# Altium project BSPD_V2.PrjPcb
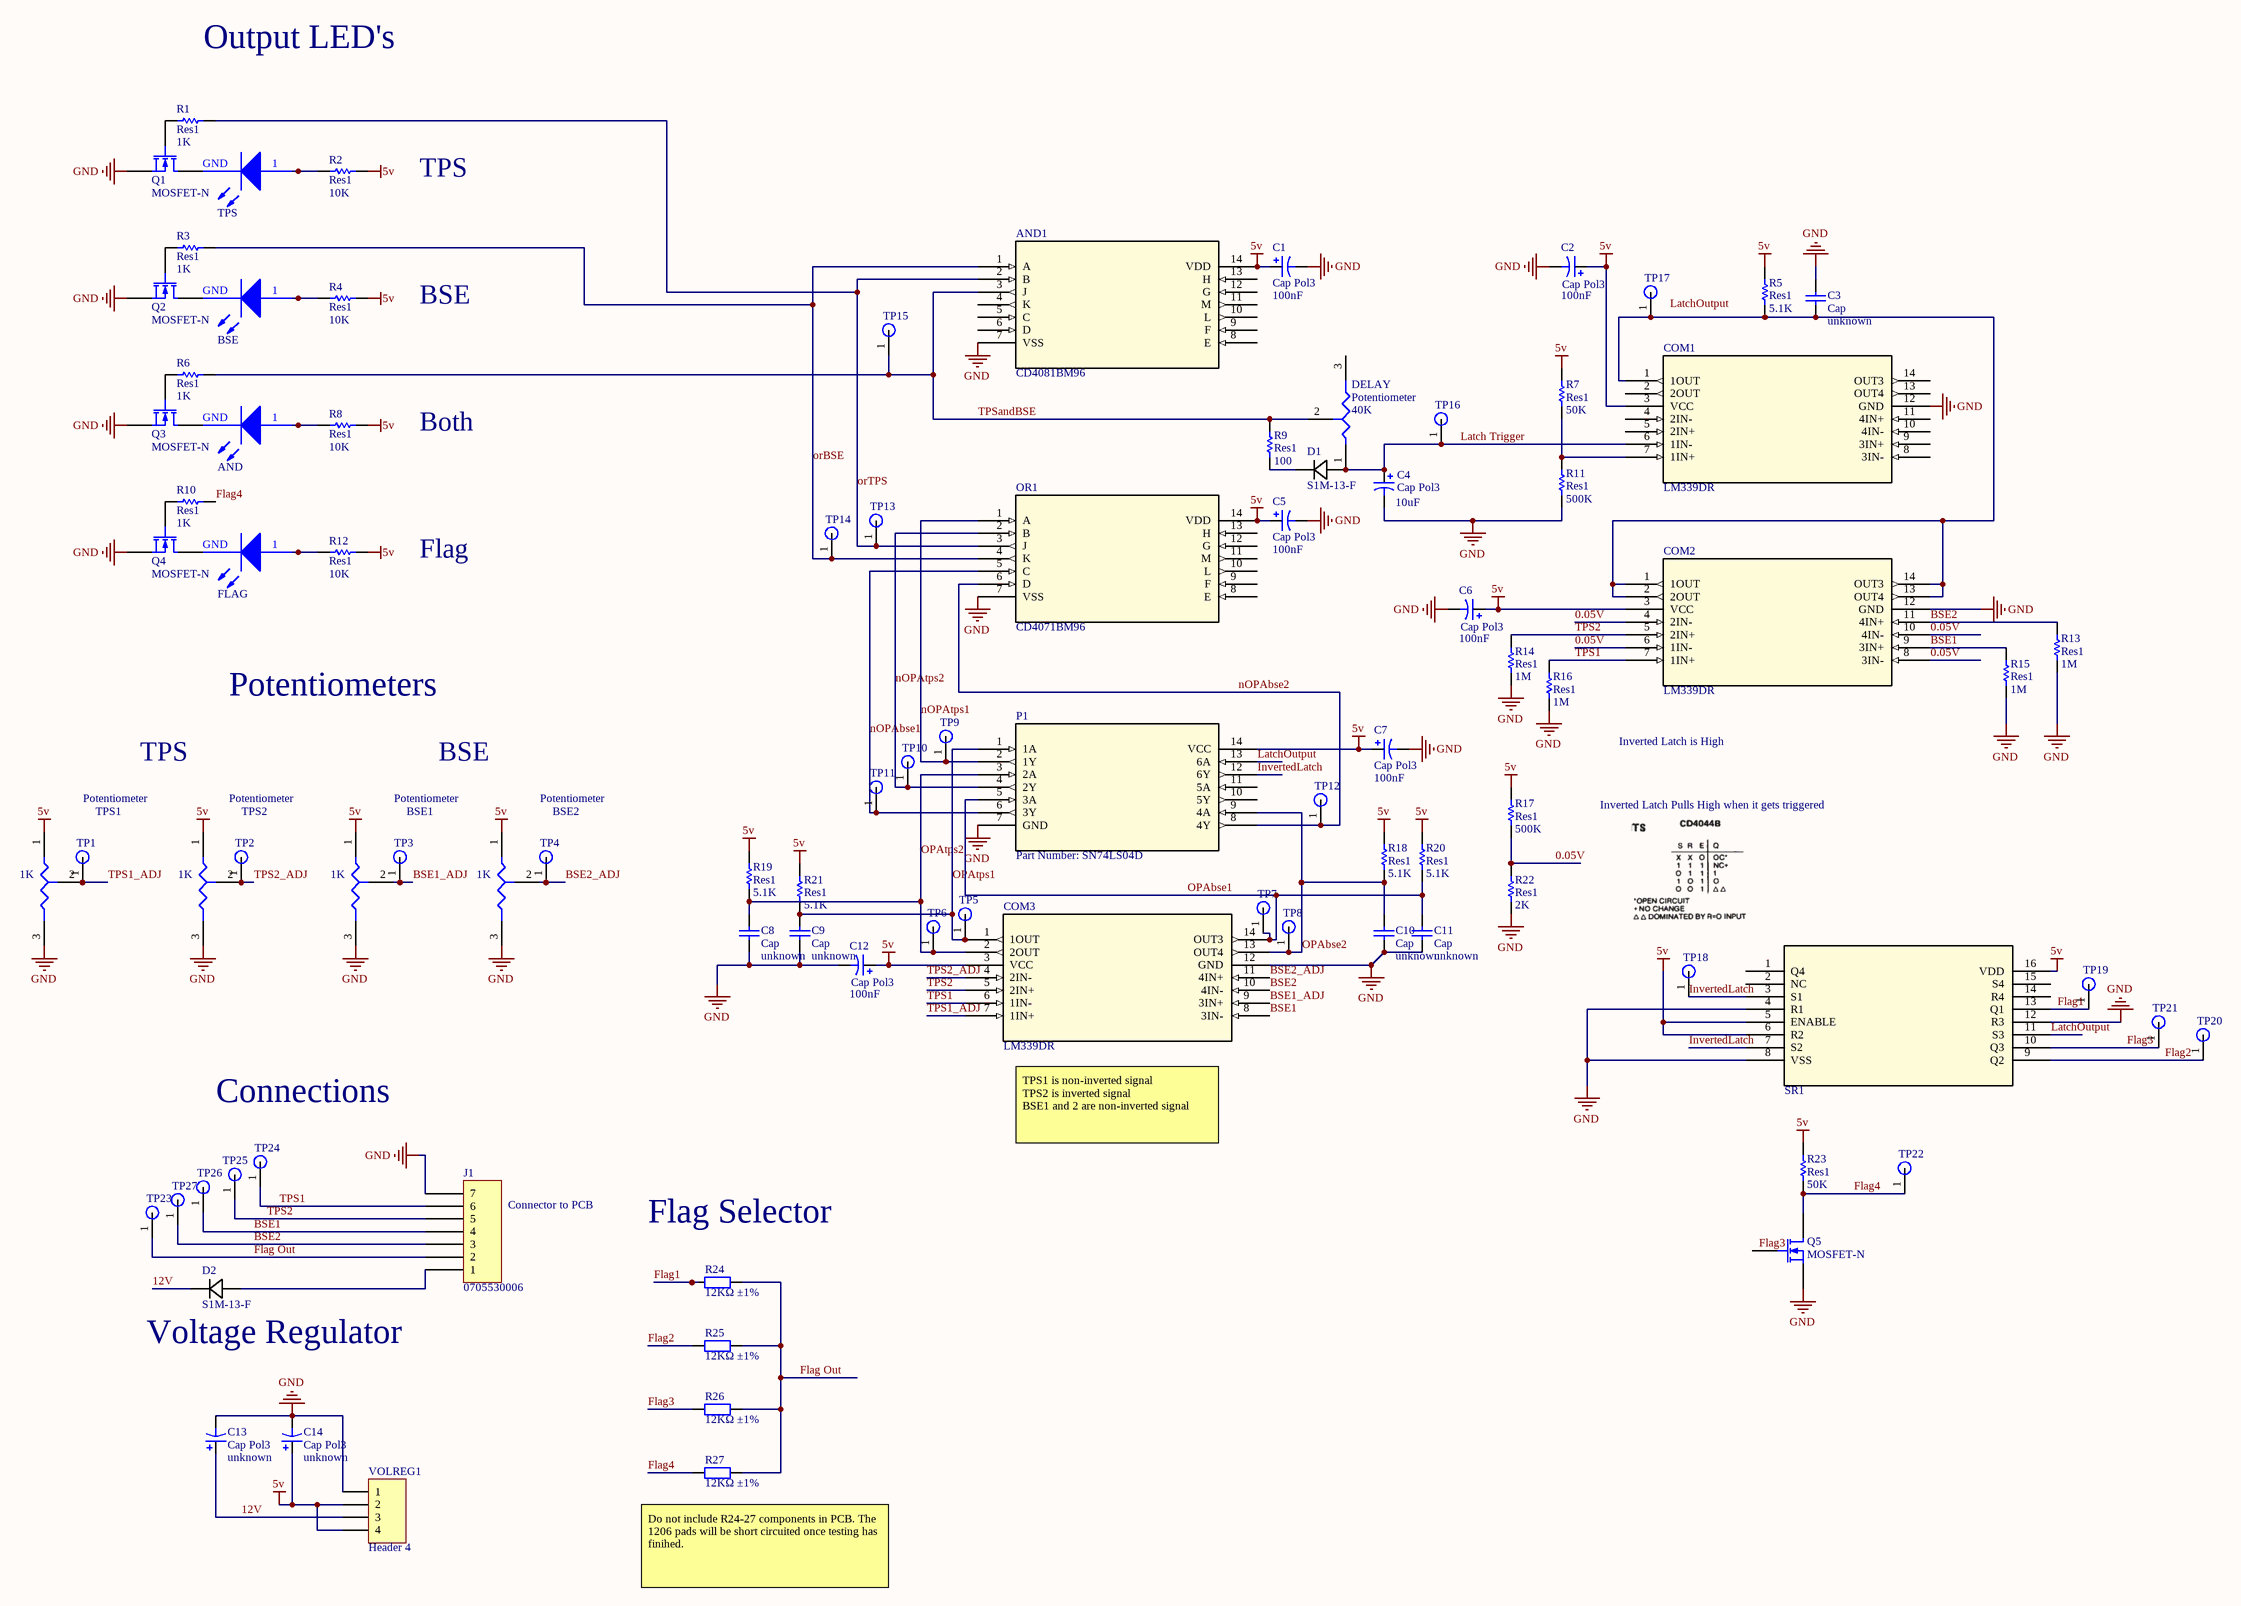
[diagram p0: BSPD_V2.1.SchDoc]
1 sheet, 93 parts. Net scope: global (net labels, ports and power ports of the same name join across sheets).
Board file: BSPD_V2.1.PcbDoc

## Sheet BSPD_V2.1.SchDoc
size C; Organization: Altium Limited; Address1: L3, 12a Rodborough Rd; Address2: Frenchs Forest; Address3: NSW; Address4: Australia 2086

### Parts
AND  Green Led  [Single_Color_LED]  (value not drawn)
AND1  CD4081BM96  [D14]
BSE  Green Led  [Single_Color_LED]  (value not drawn)
BSE1  Potentiometer  value 1K  [Potentiometers]
BSE2  Potentiometer  value 1K  [Potentiometers]
C1  Cap Pol3  value 100nF  [RC0805N]
C2  Cap Pol3  value 100nF  [RC0805N]
C3  Cap  value unknown  [RC0805N]
C4  Cap Pol3  value 10uF  [RC0805N]
C5  Cap Pol3  value 100nF  [RC0805N]
C6  Cap Pol3  value 100nF  [RC0805N]
C7  Cap Pol3  value 100nF  [RC0805N]
C8  Cap  value unknown  [RC0805N]
C9  Cap  value unknown  [RC0805N]
C10  Cap  value unknown  [RC0805N]
C11  Cap  value unknown  [RC0805N]
C12  Cap Pol3  value 100nF  [RC0805N]
C13  Cap Pol3  value unknown  [RC0805N]
C14  Cap Pol3  value unknown  [RC0805N]
COM1  LM339DR  [D14]
COM2  LM339DR  [D14]
COM3  LM339DR  [D14]
D1  S1M-13-F  [DIODE]
D2  S1M-13-F  [DIODE]
DELAY  Potentiometer  value 40K  [Potentiometers]
FLAG  Green Led  [Single_Color_LED]  (value not drawn)
J1  0705530006  [MOLEX SDA-70553-7PIN]
OR1  CD4071BM96  [D14]
P1  Part Number: SN74LS04D  [D14]
Q1  MOSFET-N  [SOT-23-3]
Q2  MOSFET-N  [SOT-23-3]
Q3  MOSFET-N  [SOT-23-3]
Q4  MOSFET-N  [SOT-23-3]
Q5  MOSFET-N  [SOT-23-3]
R1  Res1  value 1K  [RC0805N]
R2  Res1  value 10K  [RC0805N]
R3  Res1  value 1K  [RC0805N]
R4  Res1  value 10K  [RC0805N]
R5  Res1  value 5.1K  [RC0805N]
R6  Res1  value 1K  [RC0805N]
R7  Res1  value 50K  [RC0805N]
R8  Res1  value 10K  [RC0805N]
R9  Res1  value 100  [RC0805N]
R10  Res1  value 1K  [RC0805N]
R11  Res1  value 500K  [RC0805N]
R12  Res1  value 10K  [RC0805N]
R13  Res1  value 1M  [RC0805N]
R14  Res1  value 1M  [RC0805N]
R15  Res1  value 1M  [RC0805N]
R16  Res1  value 1M  [RC0805N]
R17  Res1  value 500K  [RC0805N]
R18  Res1  value 5.1K  [RC0805N]
R19  Res1  value 5.1K  [RC0805N]
R20  Res1  value 5.1K  [RC0805N]
R21  Res1  value 5.1K  [RC0805N]
R22  Res1  value 2K  [RC0805N]
R23  Res1  value 50K  [RC0805N]
R24  12KΩ ±1%  [0805_R]
R25  12KΩ ±1%  [0805_R]
R26  12KΩ ±1%  [0805_R]
R27  12KΩ ±1%  [0805_R]
SR1  CD4044BNSR  [NS16]  (value not drawn)
TP1  Test Point  [TP1]  (value not drawn)  (no BOM)
TP2  Test Point  [TP1]  (value not drawn)  (no BOM)
TP3  Test Point  [TP1]  (value not drawn)  (no BOM)
TP4  Test Point  [TP1]  (value not drawn)  (no BOM)
TP5  Test Point  [TP1]  (value not drawn)  (no BOM)
TP6  Test Point  [TP1]  (value not drawn)  (no BOM)
TP7  Test Point  [TP1]  (value not drawn)  (no BOM)
TP8  Test Point  [TP1]  (value not drawn)  (no BOM)
TP9  Test Point  [TP1]  (value not drawn)  (no BOM)
TP10  Test Point  [TP1]  (value not drawn)  (no BOM)
TP11  Test Point  [TP1]  (value not drawn)  (no BOM)
TP12  Test Point  [TP1]  (value not drawn)  (no BOM)
TP13  Test Point  [TP1]  (value not drawn)  (no BOM)
TP14  Test Point  [TP1]  (value not drawn)  (no BOM)
TP15  Test Point  [TP1]  (value not drawn)  (no BOM)
TP16  Test Point  [TP1]  (value not drawn)  (no BOM)
TP17  Test Point  [TP1]  (value not drawn)  (no BOM)
TP18  Test Point  [TP1]  (value not drawn)  (no BOM)
TP19  Test Point  [TP1]  (value not drawn)  (no BOM)
TP20  Test Point  [TP1]  (value not drawn)  (no BOM)
TP21  Test Point  [TP1]  (value not drawn)  (no BOM)
TP22  Test Point  [TP1]  (value not drawn)  (no BOM)
TP23  Test Point  [TP1]  (value not drawn)  (no BOM)
TP24  Test Point  [TP1]  (value not drawn)  (no BOM)
TP25  Test Point  [TP1]  (value not drawn)  (no BOM)
TP26  Test Point  [TP1]  (value not drawn)  (no BOM)
TP27  Test Point  [TP1]  (value not drawn)  (no BOM)
TPS  Green Led  [Single_Color_LED]  (value not drawn)
TPS1  Potentiometer  value 1K  [Potentiometers]
TPS2  Potentiometer  value 1K  [Potentiometers]
VOLREG1  Header 4  [LM1117IMPX-5.0/NOPB]

### Nets
5v: AND1.14(VDD) BSE1.1(A) BSE2.1(A) C1.1 C2.1 C5.1 C6.1 C7.1 C12.1 C14.1 COM1.3(VCC) COM2.3(VCC) COM3.3(VCC) OR1.14(VDD) P1.14(VCC) R2.1 R4.1 R5.1 R7.2 R8.1 R12.1 R17.1 R18.1 R19.1 R20.1 R21.1 R23.2 SR1.5(ENABLE) SR1.6(R2) SR1.16(VDD) TPS1.1(A) TPS2.1(A) VOLREG1.2 VOLREG1.4
GND: AND1.7(VSS) BSE1.3(B) BSE2.3(B) C1.2 C2.2 C3.2 C4.2 C5.2 C6.2 C7.2 C8.1 C9.1 C10.1 C11.1 C12.2 C13.2 C14.2 COM1.12(GND) COM2.12(GND) COM3.12(GND) J1.7 OR1.7(VSS) P1.7(GND) Q1.3(S) Q2.3(S) Q3.3(S) Q4.3(S) Q5.3(S) R11.2 R13.2 R14.2 R15.2 R16.2 R22.2 SR1.4(R1) SR1.8(VSS) SR1.12(R3) TPS1.3(B) TPS2.3(B) VOLREG1.1
0.05V: COM2.4(2IN-) COM2.6(1IN-) COM2.8(3IN-) COM2.10(4IN-) R17.2 R22.1
12V: C13.1 D2.1 VOLREG1.3
BSE1: COM2.9(3IN+) COM3.8(3IN-) J1.4 R15.1 TP26.1
BSE1_ADJ: BSE1.2(TAP) COM3.9(3IN+) TP3.1
BSE2: COM2.11(4IN+) COM3.10(4IN-) J1.3 R13.1 TP27.1
BSE2_ADJ: BSE2.2(TAP) COM3.11(4IN+) TP4.1
Flag1: R24.1 SR1.13(Q1) TP19.1
Flag2: R25.1 SR1.9(Q2) TP20.1
Flag3: R26.1 SR1.10(Q3) TP21.1
Flag4: Q5.1(D) R10.1 R23.1 R27.1 TP22.1
Flag Out: J1.2 R24.2 R25.2 R26.2 R27.2 TP23.1
InvertedLatch: P1.12(6Y) SR1.3(S1) SR1.7(S2) TP18.1
Latch Trigger: C4.1 COM1.6(1IN-) D1.2 DELAY.1(A) TP16.1
LatchOutput: P1.13(6A) SR1.11(S3)
nOPAbse1: OR1.5(C) P1.6(3Y) TP11.1
nOPAbse2: OR1.6(D) P1.8(4Y) TP12.1
nOPAtps1: OR1.1(A) P1.2(1Y) TP9.1
nOPAtps2: OR1.2(B) P1.4(2Y) TP10.1
OPAbse1: C11.2 COM3.14(OUT3) P1.5(3A) R20.2 TP7.1
OPAbse2: C10.2 COM3.13(OUT4) P1.9(4A) R18.2 TP8.1
OPAtps1: C9.2 COM3.1(1OUT) P1.1(1A) R21.2 TP5.1
OPAtps2: C8.2 COM3.2(2OUT) P1.3(2A) R19.2 TP6.1
orBSE: AND1.1(A) OR1.4(K) R3.1 TP14.1
orTPS: AND1.2(B) OR1.3(J) R1.1 TP13.1
TPS1: COM2.7(1IN+) COM3.6(1IN-) J1.6 R16.1 TP24.1
TPS1_ADJ: COM3.7(1IN+) TP1.1 TPS1.2(TAP)
TPS2: COM2.5(2IN+) COM3.5(2IN+) J1.5 R14.1 TP25.1
TPS2_ADJ: COM3.4(2IN-) TP2.1 TPS2.2(TAP)
TPSandBSE: AND1.3(J) DELAY.2(TAP) R6.1 R9.1 TP15.1
NetAND_1: AND.1(G) R8.2
NetAND_GND: AND.GND Q3.1(D)
NetBSE_1: BSE.1(G) R4.2
NetBSE_GND: BSE.GND Q2.1(D)
NetC3_1: C3.1 COM1.1(1OUT) COM2.1(1OUT) COM2.2(2OUT) COM2.13(OUT4) COM2.14(OUT3) R5.2 TP17.1
NetCOM1_7: COM1.7(1IN+) R7.1 R11.1
NetD1_1: D1.1 R9.2
NetD2_2: D2.2 J1.1
NetFLAG_1: FLAG.1(G) R12.2
NetFLAG_GND: FLAG.GND Q4.1(D)
NetQ1_1: Q1.1(D) TPS.GND
NetQ1_2: Q1.2(G) R1.2
NetQ2_2: Q2.2(G) R3.2
NetQ3_2: Q3.2(G) R6.2
NetQ4_2: Q4.2(G) R10.2
NetR2_2: R2.2 TPS.1(G)

Not connected (* = marked no-connect by the designer): AND1 4(K) 5(C) 6(D) 8(E) 9(F) 10(L) 11(M) 12(G) 13(H); COM1 2(2OUT) 4(2IN-) 5(2IN+) 8(3IN-) 9(3IN+) 10(4IN-) 11(4IN+) 13(OUT4) 14(OUT3); DELAY 3(B); OR1 8(E) 9(F) 10(L) 11(M) 12(G) 13(H); P1 10(5Y) 11(5A); Q5 2(G); SR1 1(Q4) 2(NC) 14(R4) 15(S4)

### Notes on the sheet
- Output LED's
- TPS
- BSE
- Both
- Flag
- Potentiometers
- Inverted Latch is High
- Inverted Latch Pulls High when it gets triggered
- Connections
- TPS1 is non-inverted signal
  TPS2 is inverted signal
  BSE1 and 2 are non-inverted signal
- (near J1) Connector to PCB
- Flag Selector
- (near D2) Voltage Regulator
- (near R27) Do not include R24-27 components in PCB. The 1206 pads will be short circuited once testing has finihed.
- Labels drawn without touching a wire or pin: Flag3, LatchOutput
- Title
- Size:
- Date:
- File:
- C
- Number:
- Time:
- Revision:
- Sheet
- of

### Library data of the parts
AND BSE FLAG TPS = Green_LED: DK: 1497-1160-1-ND || MF: XZM2DG45SB
AND1 = CD4081BM96: Imported; Vendor: Texas Instruments; Built_By: EMA_UL_Team; C: Copyright (C) 2015 Accelerated Designs. All rights reserved; Manufacturer_Part_Number: CD4081BM96; RefDes: RefDes; Type: DEV; Value: Value
BSE1 BSE2 DELAY TPS1 TPS2 = Potentiometer: Tapped Resistor; Sim Note: Enter the Resistance value and the set point into parameter fields.; Set Position: 0.5; Published: 24-Mar-1999; LatestRevisionDate: 17-Jul-2002; LatestRevisionNote: Re-released for DXP Platform.; PackageReference: VR3; Publisher: Altium Limited; PackageDescription: Variable Resistor, Thru-Hole; 3 Leads
C1 C2 C4-C7 C12-C14 = Cap Pol3: Polarized Capacitor (Surface Mount); Published: 8-Jun-2000; LatestRevisionDate: 29-May-2009; LatestRevisionNote: IPC-7351 Footprint Added.; PackageReference: C0805; Publisher: Altium Limited; PackageDescription: Chip Capacitor
C3 C8-C11 = Cap: Capacitor; Published: 8-Jun-2000; LatestRevisionDate: 17-Jul-2002; LatestRevisionNote: Re-released for DXP Platform.; PackageReference: RAD-0.3; Publisher: Altium Limited; PackageDescription: Radial Cap, Thru-Hole; 2 Leads; 0.3 in Pin Spacing
COM1-COM3 = LM339DR: Imported; Manufacturer: Texas Instruments; Built_By: EMA_UL_Team; C: Copyright (C) 2015 Accelerated Designs. All rights reserved; Vendor: Vendor; Manufacturer_Part_Number: LM339DR; RefDes: RefDes; Type: DEV; Value: Value
D1 D2 = S1M-13-F: Imported; Vendor: Diodes Inc; Built_By: EMA_UL_Team; Type: DEV; C: Copyright (C) 2015 Accelerated Designs. All rights reserved; Manufacturer_Part_Number: S1M-13-F; RefDes: RefDes; Value: Value
J1 = 0705530006: CONN HEADER R/A 7POS 2.54MM; Manufacturer: Molex; Contact Length - Mating: 0.240" (6.10mm); Contact Length - Post: 0.130" (3.30mm); Material Flammability Rating: UL94 V-0; Number of Positions: 7; Number of Positions Loaded: All; Pitch - Mating: 0.100" (2.54mm); Shrouding: Shrouded - 4 Wall; Style: Board to Cable/Wire; Voltage Rating: 250V; Part Number: 0705530006; ComponentLink1Description: Datasheet; ComponentLink1URL: https://www.molex.com/pdm_docs/sd/705530006_sd.pdf; ComponentLink2Description: DigiKey Link; ComponentLink2URL: http://digikey.com/product-detail/en/molex/0705530006/WM4905-ND/114971; Connector Type: Header; Contact Finish - Mating: Gold; Contact Finish - Post: Tin; Contact Finish Thickness - Mating: 15.0µin (0.38µm); Contact Material: Phosphor Bronze; Contact Shape: Square; Contact Type: Male Pin; Fastening Type: Latch Holder; Insulation Color: Black; Insulation Height: 0.215" (5.45mm); Insulation Material: Polyester, Glass Filled; LastUpdated: 2020-01-12 11:57:03 PM; Lifecycle Status: Active; Minimum Order: 1; Mounting Type: Through Hole, Right Angle; Number of Rows: 1; Operating Temperature: -40°C ~ 105°C; Packaging: Tube; PartId: 90; Part Status: Active; Price: 3.15; Series: SL 70553; Supplier 1: DigiKey; Supplier Part Number 1: WM4905-ND; Termination: Solder
OR1 = CD4071BM96: Imported; Vendor: Texas Instruments; Built_By: EMA_UL_Team; C: Copyright (C) 2015 Accelerated Designs. All rights reserved; Manufacturer_Part_Number: CD4071BM96; RefDes: RefDes; Type: DEV; Value: Value
P1 = SN74LS04D: No Description Available; Vendor: Texas Instruments; Built_By: EMA_UL_Team; Manufacturer_Part_Number: SN74LS04D; Copyright: Copyright (C) 2018 Accelerated Designs. All rights reserved; RefDes: RefDes; Type: DEV; Value: Value
Q1-Q5 = MOSFET-N: N-Channel MOSFET; Published: 8-Jun-2000; LatestRevisionDate: 17-Jul-2002; LatestRevisionNote: Re-released for DXP Platform.; PackageVersion: 1995/1996; PackageReference: E3; Publisher: Altium Limited; PackageDescription: TO, Flat Index; 3 In-Line, Axial Leads; Body Dia. 4.6mm; Lead Dia. 0.5 mm (max)
R1-R23 = Res1: Resistor; Published: 8-Jun-2000; LatestRevisionDate: 17-Jul-2002; LatestRevisionNote: Re-released for DXP Platform.; PackageReference: AXIAL-0.3; Publisher: Altium Limited; PackageDescription: Axial Device, Thru-Hole; 2 Leads; 0.3 in Pin Spacing
R24-R27 = 0805 12K (1202) 1%: Chip resistor; Manufacturer: Uniroyal Elec; Power: 1/8W; ComponentLink1Description: Supplier link; ComponentLink1URL: http://www.szlcsc.com/product/details_18132.html; Package: 0805; Supplier: LC; SuppliersPartNumber: C17444; Tolerance: 1%
SR1 = SR Latch Quad: IC QUAD NAND R/S LATCH 16SO; Supplier 1: Digi-Key; Supplier 2: Mouser; Supplier Part Number 1: 296-12762-1-ND; Supplier Part Number 2: 595-CD4044BNSR
TP1-TP27 = TP1
VOLREG1 = Header 4: Header, 4-Pin; LatestRevisionDate: 17-Jul-2002; LatestRevisionNote: Re-released for DXP Platform.; Publisher: Altium Limited